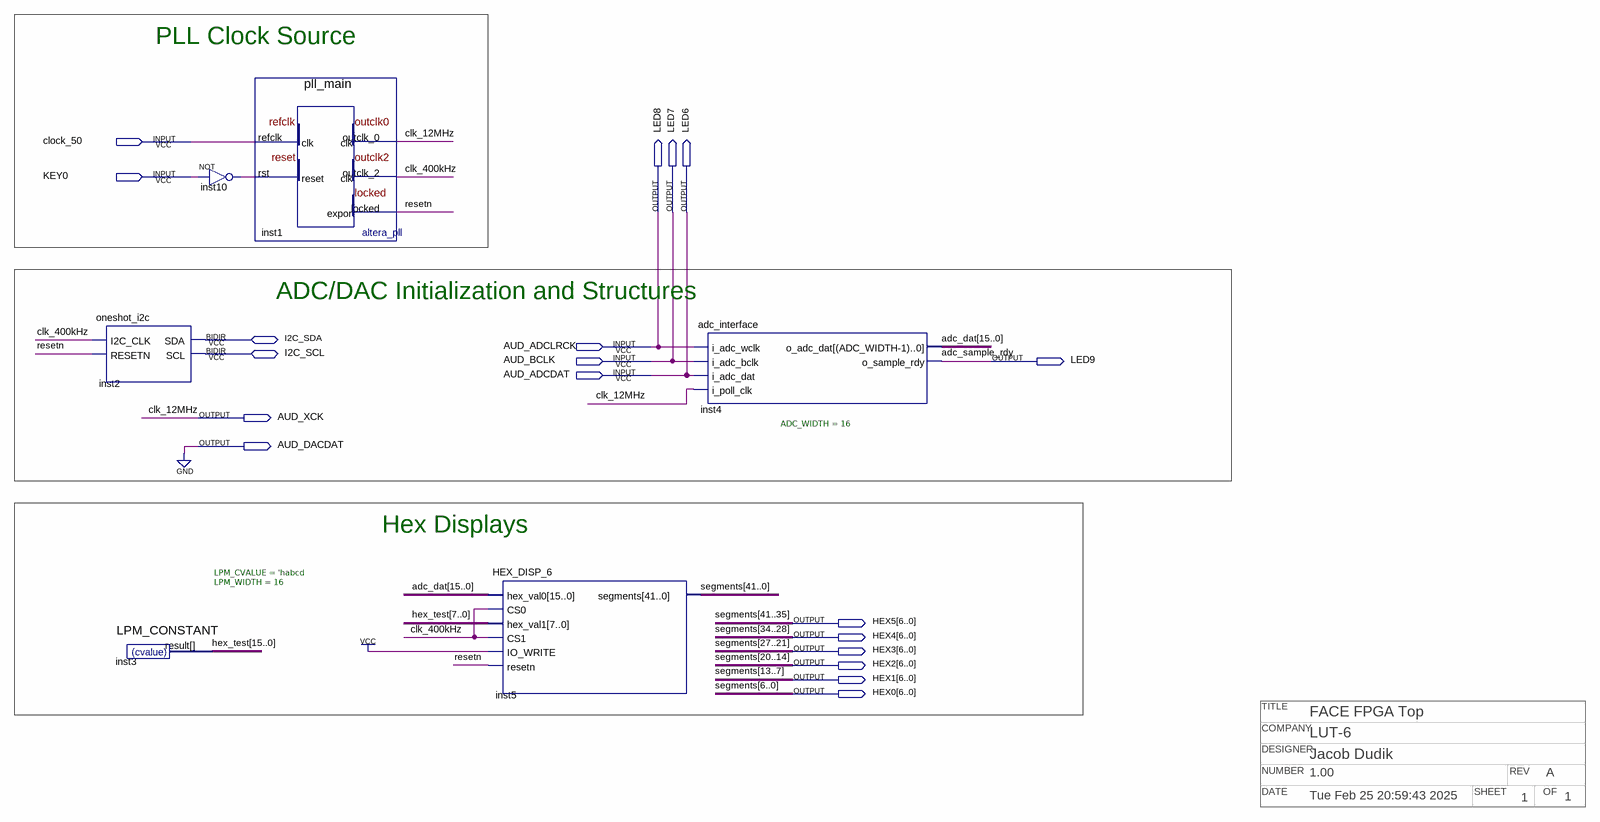
[diagram p0: schematic sheet]
// Quartus schematic FACE.bdf as structural Verilog: 6 symbols, 19 pins
// Title block: TITLE: FACE FPGA Top; COMPANY: LUT-6; DESIGNER: Jacob Dudik; NUMBER: 1.00; REV: A; DATE: Tue Feb 25 20:59:43 2025; SHEET: 1; OF: 1
module FACE (
  input  clock_50,
  input  KEY0,
  input  AUD_ADCLRCK,
  input  AUD_BCLK,
  input  AUD_ADCDAT,
  inout  I2C_SDA,
  inout  I2C_SCL,
  output LED8,
  output LED7,
  output LED6,
  output LED9,
  output AUD_XCK,
  output AUD_DACDAT,
  output [6:0] HEX5,
  output [6:0] HEX4,
  output [6:0] HEX3,
  output [6:0] HEX2,
  output [6:0] HEX1,
  output [6:0] HEX0
);

  wire clk_400kHz, inst10_out, resetn;
  wire [15:0] adc_dat, hex_test;

  oneshot_i2c inst2 (.I2C_CLK(clk_400kHz), .RESETN(resetn), .SDA(I2C_SDA), .SCL(I2C_SCL));
  LPM_CONSTANT #(.LPM_CVALUE('habcd), .LPM_WIDTH(16)) inst3 (.result(hex_test));
  not inst10 (inst10_out, KEY0);
  pll_main inst1 (.refclk(clock_50), .rst(inst10_out), .outclk_0(AUD_XCK), .outclk_2(clk_400kHz), .locked(resetn));
  HEX_DISP_6 inst5 (
    .hex_val0(adc_dat), .CS0(clk_400kHz), .hex_val1(hex_test[7:0]), .CS1(clk_400kHz), .IO_WRITE(1'b1),
    .resetn(resetn), .segments({HEX5, HEX4, HEX3, HEX2, HEX1, HEX0}));
  adc_interface #(.ADC_WIDTH(16)) inst4 (
    .i_adc_wclk(AUD_ADCLRCK), .i_adc_bclk(AUD_BCLK), .i_adc_dat(AUD_ADCDAT), .i_poll_clk(AUD_XCK),
    .o_adc_dat(adc_dat), .o_sample_rdy(LED9));

  assign AUD_DACDAT = 1'b0;
  assign LED6 = AUD_ADCDAT;
  assign LED7 = AUD_BCLK;
  assign LED8 = AUD_ADCLRCK;

  // Other names for the same wires on the sheet: adc_sample_rdy = LED9; clk_12MHz = AUD_XCK;
  //   segments[41:0] = {HEX5, HEX4, HEX3, HEX2, HEX1, HEX0}

  // Notes on the sheet:
  //   PLL Clock Source
  //   ADC/DAC Initialization and Structures
  //   Hex Displays
endmodule
